# EAGLE design analogTCO-RJ-alone-ext (EAGLE 6.6.0)
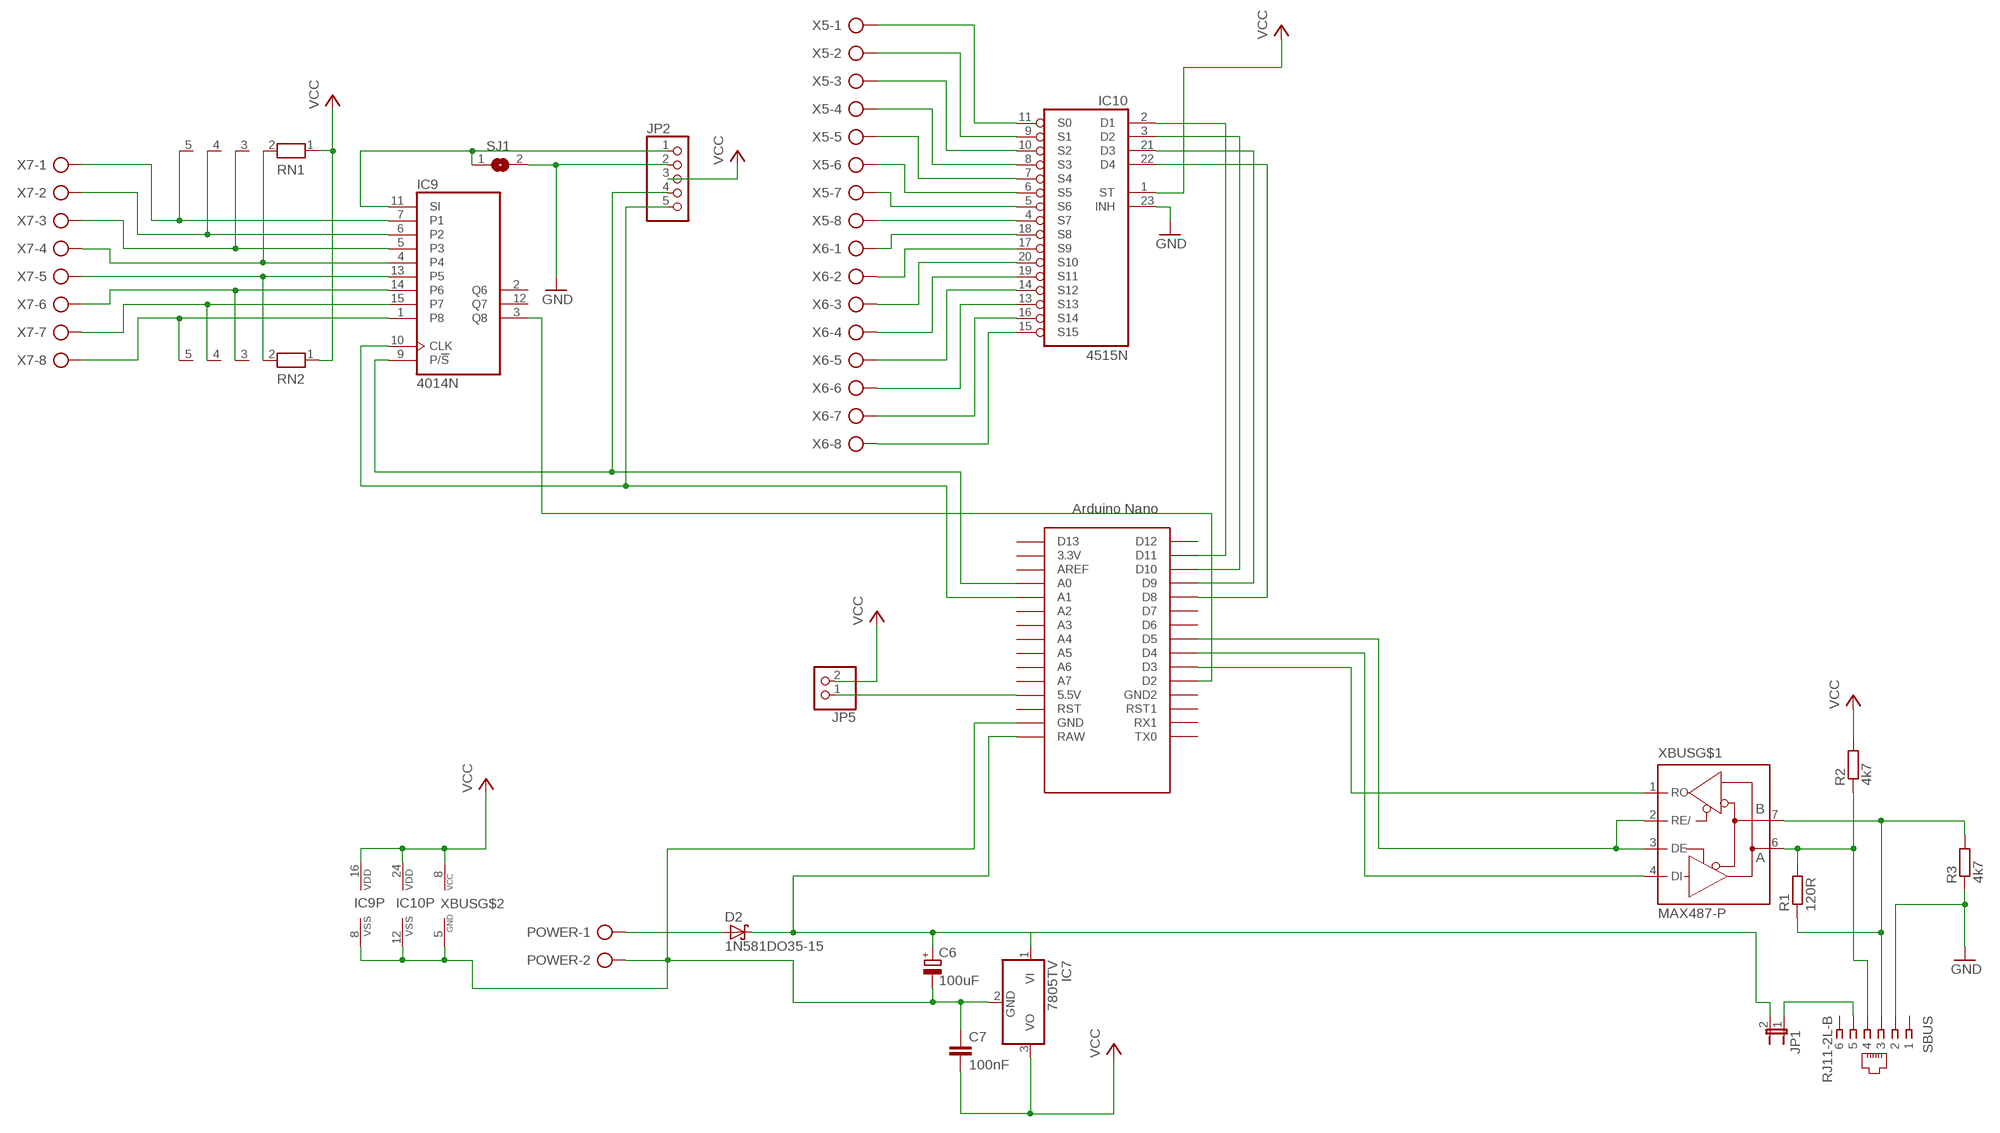
[diagram p0: schematic, sheet 1]

## Parts
C6  100uF  CPOL-EUE2.5-6  [E2,5-6]
C7  100nF  C-EU025-025X050  [C025-025X050]
D2  1N581DO35-15  [DO35-10]
IC7  7805TV  [TO220V]
IC9  4014N  [DIL16]
IC10  4515N  [DIL24-6]
JP1  JP1E  [JP1]
JP2  PINHD-1X5  [1X05]
JP5  PINHD-1X2  [1X02]
POWER  AK500/2  [AK500/2]
R1  120R  R-EU_0207/12  [0207/12]
R2  4k7  R-EU_0207/12  [0207/12]
R3  4k7  R-EU_0207/12  [0207/12]
RN1  RN04  [RN-5]
RN2  RN04  [RN-5]
SBUS  RJ11-2L-B  [RJ11-NO_SHIELD]
SJ1  SJ  [SJ]
U$1  NANO  [NANO]
X5  AK500/8  [AK500/8]
X6  AK500/8  [AK500/8]
X7  AK500/8  [AK500/8]
XBUS  MAX487-P  [DIL08]

## Nets
+12V: C6.+ D2.C IC7.1(VI) JP1.2 U$1.RAW
GND: C6.- C7.1 IC7.2(GND) IC9.8(VSS) IC10.12(VSS) IC10.23(INH) JP2.2 POWER.2 R3.1 SBUS.2 SJ1.2 U$1.GND XBUS.5(GND)
N$1: U$1.D5 XBUS.2(RE/) XBUS.3(DE)
N$2: U$1.D3 XBUS.1(RO)
N$3: U$1.D4 XBUS.4(DI)
N$4: R1.2 R2.1 SBUS.4 XBUS.6(A)
N$5: R1.1 R3.2 SBUS.3 XBUS.7(B)
N$6: JP5.1 U$1.5V(5.5V)
N$8: JP1.1 SBUS.5
N$9: IC9.11(SI) JP2.1 SJ1.1
N$26: IC10.3(D2) U$1.D10
N$27: IC10.2(D1) U$1.D11
N$70: IC9.9(P/!S) JP2.4 U$1.A0
N$71: IC9.10(CLK) JP2.5 U$1.A1
N$73: IC9.3(Q8) U$1.D2
N$74: IC10.11(S0) X5.1
N$75: IC10.9(S1) X5.2
N$76: IC10.10(S2) X5.3
N$77: IC10.8(S3) X5.4
N$78: IC10.7(S4) X5.5
N$79: IC10.6(S5) X5.6
N$80: IC10.5(S6) X5.7
N$81: IC10.4(S7) X5.8
N$82: IC10.18(S8) X6.1
N$83: IC10.17(S9) X6.2
N$84: IC10.20(S10) X6.3
N$85: IC10.19(S11) X6.4
N$86: IC10.14(S12) X6.5
N$87: IC10.13(S13) X6.6
N$88: IC10.16(S14) X6.7
N$89: IC10.15(S15) X6.8
N$90: IC9.7(P1) RN1.5 X7.1
N$91: IC9.6(P2) RN1.4 X7.2
N$92: IC9.5(P3) RN1.3 X7.3
N$93: IC9.4 RN1.2 X7.4
N$94: IC9.13(P5) RN2.2 X7.5
N$95: IC9.14(P6) RN2.3 X7.6
N$96: IC9.15(P7) RN2.4 X7.7
N$97: IC9.1(P8) RN2.5 X7.8
N$98: IC10.21(D3) U$1.D9
N$99: IC10.22(D4) U$1.D8
N$109: D2.A POWER.1
VCC: C7.2 IC7.3(VO) IC9.16(VDD) IC10.1(ST) IC10.24(VDD) JP2.3 JP5.2 R2.2 RN1.1 RN2.1 XBUS.8(VCC)
Unconnected: IC9.2(Q6) IC9.12(Q7) SBUS.1 SBUS.6 U$1.3.3V U$1.A2 U$1.A3 U$1.A4 U$1.A5 U$1.A6 U$1.A7 U$1.AREF U$1.D6 U$1.D7 U$1.D12 U$1.D13 U$1.GND1(GND2) U$1.ICSP1 U$1.ICSP2 U$1.ICSP3 U$1.ICSP4 U$1.ICSP5 U$1.ICSP6 U$1.RST U$1.RST1 U$1.RX1 U$1.TX0

## Library data of the parts
C6 = resistor:CPOL-EU: POLARIZED CAPACITOR, European symbol
C7 = rcl:C-EU: CAPACITOR, European symbol
D2 = custom:1N581*: 1.0A SCHOTTKY BARRIER RECTIFIER Source: http://www.diodes.com/datasheets/ds23001.pdf
IC7 = linear:78*: Positive VOLTAGE REGULATOR Source: http://cache.national.com/ds/LM/LM78L05.pdf http://www.fairchildsemi.com/ds/LM/LM7805.pdf
IC9 = 40xx:4014: 8-bit static SHIFT REGISTER
IC10 = 45xx:4515: 4-bit latch 4-16 line DECODER
JP1 = jumper:JP1E: JUMPER
JP2 = pinhead:PINHD-1X5: PIN HEADER
JP5 = pinhead:PINHD-1X2: PIN HEADER
POWER = con-ptr500:AK500/2: CONNECTOR; OC_FARNELL: unknown; OC_NEWARK: unknown
R1-R3 = resistor:R-EU_: RESISTOR, European symbol
RN1 RN2 = resistor-net:RN04: RESISTOR NETWORK; OC_FARNELL: unknown; OC_NEWARK: unknown
SBUS = con-tycoelectronics:RJ11: CORCOM Modular RJ Jacks No Shield Source: www.tycoelectronics.com .. ENG_DS_1654001_1099_RJ_L_0507.pdf; MF: TYCO ELECTRONICS; MPN: RJ11-2L-B; OC_FARNELL: unknown; OC_NEWARK: 83F4463
SJ1 = jumper:SJ: SMD solder JUMPER
U$1 = Arduino-clone:NANO: Arduino Nano
X5-X7 = con-ptr500:AK500/8: CONNECTOR; OC_FARNELL: unknown; OC_NEWARK: unknown
XBUS = rs232-rs485:MAX487: RS485 TRANSEIVER

## Board
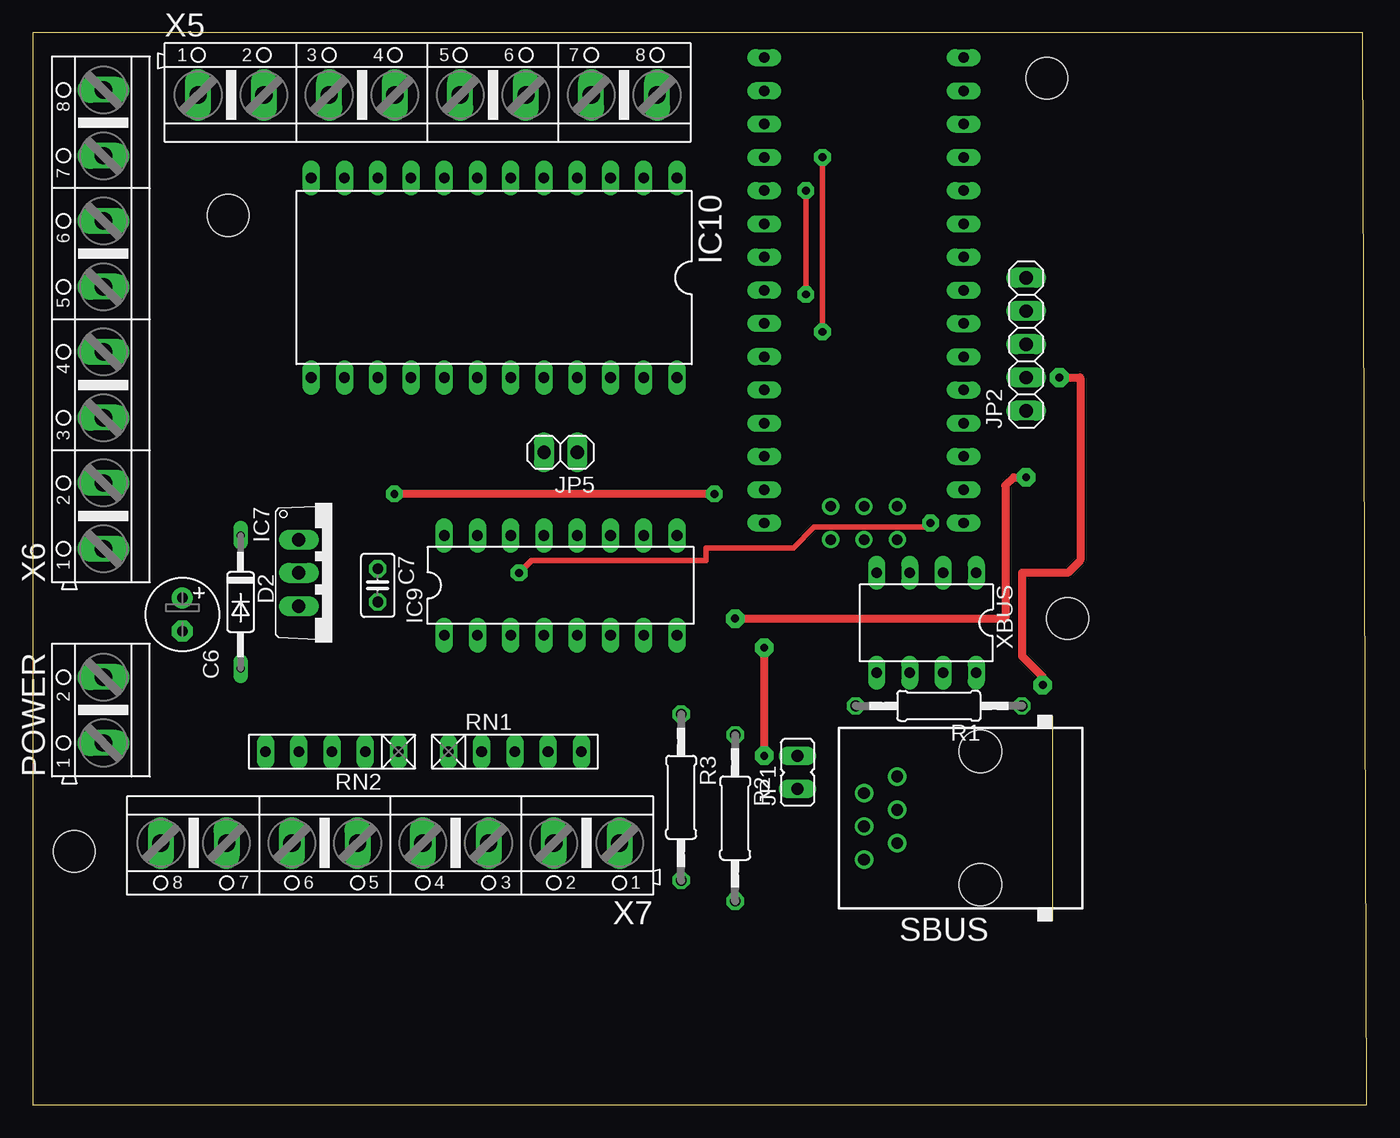
[diagram p1: board, top side]
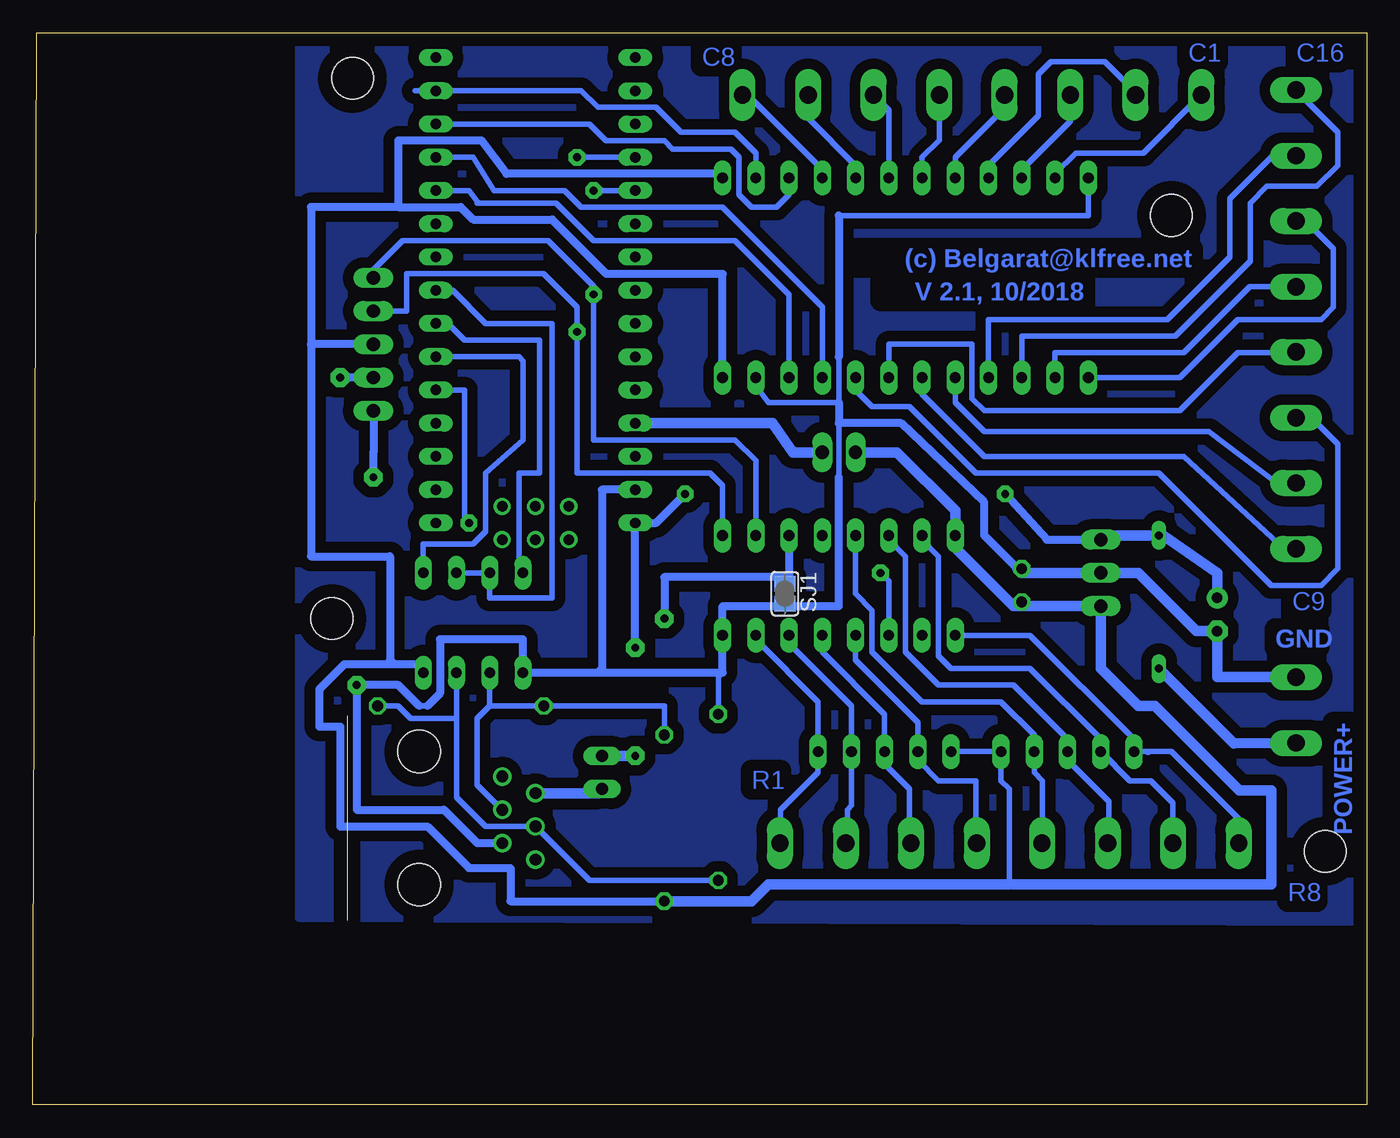
[diagram p2: board, bottom side, seen from below]

Size 101.91 x 81.91 mm. Coordinates in mm from the lower left corner, seen from the top.
Outline: 0,0 101.9,0 101.59,81.91 0,81.91 0,0
Copper layers (1*16): Top 0.035mm / dielectric 1.5mm / Bottom 0.035mm
Design rules "default *": minimum track width 10mil, minimum drill 0.6mm, track to track 8mil, track to pad 8mil, pad to pad 8mil, via to via 8mil, smd to smd 8mil, copper to edge 40mil, drill to drill 8mil, minimum pad ring 10mil, minimum via ring 8mil, stop-mask expansion 4mil, vias tented up to drill 0mil, thermal gap 10mil
Holes 3.2 mm at 77.47,78.42 79.06,37.15 3.17,19.37 14.92,67.94

### Footprints (pad centres in the part's own frame; a part is rotated, then mirrored left to right if it is on the bottom)
E2,5-6 = drill 0.813 pad 1.6: + -1.27,0 | drill 0.813 pad 1.6 octagon: - 1.27,0
C025-025X050 = drill 0.813 octagon: 1 -1.27,0; 2 1.27,0
DO35-10 = drill 0.6 long: A 5.08,0; C -5.08,0
TO220V = drill 1.016 long: 1 -2.54,-2.54; 2 0,-2.54; 3 2.54,-2.54
DIL16 = drill 0.813 long: 1 -8.89,-3.81; 2 -6.35,-3.81; 3 -3.81,-3.81; 4 -1.27,-3.81; 5 1.27,-3.81; 6 3.81,-3.81; 7 6.35,-3.81; 8 8.89,-3.81; 9 8.89,3.81; 10 6.35,3.81; 11 3.81,3.81; 12 1.27,3.81; 13 -1.27,3.81; 14 -3.81,3.81; 15 -6.35,3.81; 16 -8.89,3.81
DIL24-6 = drill 0.813 long: 1 -13.97,-7.62; 2 -11.43,-7.62; 3 -8.89,-7.62; 4 -6.35,-7.62; 5 -3.81,-7.62; 6 -1.27,-7.62; 7 1.27,-7.62; 8 3.81,-7.62; 9 6.35,-7.62; 10 8.89,-7.62; 11 11.43,-7.62; 12 13.97,-7.62; 13 13.97,7.62; 14 11.43,7.62; 15 8.89,7.62; 16 6.35,7.62; 17 3.81,7.62; 18 1.27,7.62; 19 -1.27,7.62; 20 -3.81,7.62; 21 -6.35,7.62; 22 -8.89,7.62; 23 -11.43,7.62; 24 -13.97,7.62
JP1 = drill 0.914 long: 1 0,-1.27; 2 0,1.27
1X05 = drill 1.016 long: 1 -5.08,0; 2 -2.54,0; 3 0,0; 4 2.54,0; 5 5.08,0
1X02 = drill 1.016 long: 1 -1.27,0; 2 1.27,0
AK500/2 = drill 1.321 long: 1 -2.515,0; 2 2.515,0
0207/12 = drill 0.813 octagon: 1 -6.35,0; 2 6.35,0
RN-5 = drill 0.813 long: 1 -5.08,0; 2 -2.54,0; 3 0,0; 4 2.54,0; 5 5.08,0
RJ11-NO_SHIELD = drill 0.9 pad 1.4: 1 -3.175,8.89; 2 -1.905,6.35; 3 -0.635,8.89; 4 0.635,6.35; 5 1.905,8.89; 6 3.175,6.35 | hole 3.251: -5.08,0; 5.08,0
SJ = smd 1.168 x 1.6: 1 -0.762,0; 2 0.762,0
NANO = drill 0.8 long: 3.3V -10.16,24.13; 5V -10.16,-1.27; A0 -10.16,19.05; A1 -10.16,16.51; A2 -10.16,13.97; A3 -10.16,11.43; A4 -10.16,8.89; A5 -10.16,6.35; A6 -10.16,3.81; A7 -10.16,1.27; AREF -10.16,21.59; D2 5.08,1.27; D3 5.08,3.81; D4 5.08,6.35; D5 5.08,8.89; D6 5.08,11.43; D7 5.08,13.97; D8 5.08,16.51; D9 5.08,19.05; D10 5.08,21.59; D11 5.08,24.13; D12 5.08,26.67; D13 -10.16,26.67; GND -10.16,-6.35; GND1 5.08,-1.27; RAW -10.16,-8.89; RST -10.16,-3.81; RST1 5.08,-3.81; RX1 5.08,-6.35; TX0 5.08,-8.89 | drill 0.8: ICSP1 -5.08,-10.16; ICSP2 -5.08,-7.62; ICSP3 -2.54,-10.16; ICSP4 -2.54,-7.62; ICSP5 0,-10.16; ICSP6 0,-7.62
AK500/8 = drill 1.321 long: 1 -17.526,0; 2 -12.497,0; 3 -7.518,0; 4 -2.489,0; 5 2.489,0; 6 7.518,0; 7 12.497,0; 8 17.526,0
DIL08 = drill 0.8 long: 1 -3.81,-3.81; 2 -1.27,-3.81; 3 1.27,-3.81; 4 3.81,-3.81; 5 3.81,3.81; 6 1.27,3.81; 7 -1.27,3.81; 8 -3.81,3.81

### Placement (x,y rotation side)
C6  11.43,37.47 270 top
C7  26.35,39.69 270 top
D2  15.88,38.42 270 top
IC7  22.86,40.64 270 top
IC9  40.32,39.69 0 top
IC10  35.24,63.18 180 top
JP1  58.42,25.4 0 top
JP2  75.88,58.1 90 top
JP5  40.32,49.85 180 top
POWER  5.4,30.16 90 top
R1  69.22,30.48 180 top
R2  53.66,21.91 270 top
R3  49.53,23.49 270 top
RN1  36.83,26.99 0 top
RN2  22.86,26.99 180 top
SBUS  72.39,21.91 90 top
SJ1  44.45,39.05 270 bottom
U$1  66.04,53.34 0 top
X5  30.16,77.15 0 top
X6  5.4,60.01 90 top
X7  27.3,20 180 top
XBUS  68.26,36.83 180 top

### Tracks (layer width: path | path; a pad name or v marks a point on that pad's centre or on a via)
+12V  (via drill 0.6 pad 1.27, 0.6 pad 1.42)
  Top 0.61: v52.07,46.67 v27.62,46.67 | v55.88,26.67 v55.88,34.93
  Bottom 0.61: v52.07,46.67 54.29,44.45 U$1.RAW 55.64,44.21 arc45 55.88,44.03 v55.88,34.93 | v27.62,46.67 24.45,43.18 IC7.1
  Bottom 0.813: C6.+ 11.43,40.64 15.56,43.5 D2.C 20,43.5 IC7.1 | v55.88,26.67 JP1.2
GND  (via drill 0.6 pad 1.42)
  Top 0.61: v78.42,55.56 80.01,55.56 80.01,41.59 79.06,40.64 75.57,40.64 75.57,34.29 77.15,32.7 v77.15,32.07
  Bottom 0.406: IC10.23 46.67,54.93 45.72,53.66 40.32,53.66 40.32,57.15 | IC10.12 21.27,67.94 40.32,67.94 | 40.32,52.07 40.32,47.94 | R3.1 49.53,32.7 49.21,33.02 | 71.76,30.48 72.39,30.48
  Bottom 0.61: 45.09,38.1 49.21,38.1 IC9.8 49.21,33.02 58.74,33.02 | 45.09,38.1 40.32,38.1 40.32,47.94 | 40.32,53.66 40.32,52.07 35.56,52.07 29.21,46.04 29.21,43.5 26.67,40.96 | 40.32,67.94 40.32,57.15 | 58.74,33.02 XBUS.5 64.45,35.56 70.8,35.56 70.8,31.43 71.76,30.48 | 72.39,30.48 73.98,32.07 v77.15,32.07 77.15,22.54 70.48,22.54 67.95,20 SBUS.2 | U$1.GND 58.42,46.99 58.42,33.34 58.74,33.02 | JP2.2 v78.42,55.56 | SJ1.2 44.89,38.29 45.09,38.1
  Bottom 0.813: POWER.2 5.4,32.7 11.43,32.7 C6.- 13.02,36.19 17.46,40.64 IC7.2 | IC7.2 20.64,40.64 20.95,40.32 20.64,40.32 IC7.2 | IC7.2 26.35,40.64 C7.1 26.67,40.96
N$1
  Bottom 0.406: XBUS.2 XBUS.3 66.99,38.73 62.23,38.73 62.23,59.69 67.31,59.69 69.85,62.23 U$1.D5
N$2
  Bottom 0.406: U$1.D3 64.77,57.15 64.45,56.83 64.45,50.8 67.31,48.26 67.31,43.82 68.26,42.86 72.07,42.86 XBUS.1
N$3
  Bottom 0.406: XBUS.4 64.77,40.96 64.77,48.26 63.18,48.26 63.18,58.42 68.9,58.42 70.17,59.69 U$1.D4
N$4
  Bottom 0.406: XBUS.6 66.99,30.48 | 66.99,30.48 R1.2 53.66,30.48 R2.1 | SBUS.4 67.95,24.45 67.95,29.53 66.99,30.48
N$5
  Bottom 0.406: XBUS.7 69.53,29.53 | 69.53,29.53 73.03,29.53 73.98,30.48 R1.1 | 69.53,29.53 69.53,23.49 67.31,21.27 SBUS.3 59.37,17.15 R3.2
N$6
  Bottom 0.813: U$1.5V 45.4,52.07 43.81,49.85 JP5.1
N$7
  pour Bottom (isolate 0.813): 0.63,81.6 81.6,81.91 81.6,14.29 0.63,13.97
N$8
  Bottom 0.813: SBUS.5 58.74,23.81 JP1.1
N$9  (via drill 0.6 pad 1.42)
  Top 0.61: v53.66,37.15 74.29,37.15 74.29,47.31 74.93,47.94 v75.88,47.94
  Bottom 0.61: IC9.11 44.13,40.32 45.09,40.32 | 45.09,40.32 53.66,40.32 v53.66,37.15 | JP2.1 75.88,52.39 75.88,49.85 v75.88,47.94 | SJ1.1 44.58,39.81 45.09,40.32
N$26
  Bottom 0.406: U$1.D10 59.37,74.93 58.1,73.66 53.66,73.66 53.02,73.02 48.58,73.02 47.94,72.39 47.94,69.53 46.99,68.58 45.09,68.58 44.13,69.53 IC10.3
N$27
  Bottom 0.406: 72.71,77.47 U$1.D11 60.01,77.47 58.74,76.2 54.29,76.2 52.39,74.3 48.26,74.3 46.67,72.71 IC10.2
N$70  (via drill 0.6 pad 1.27)
  Top 0.406: v60.32,72.39 v60.32,59.05
  Bottom 0.406: U$1.A0 v60.32,72.39 | IC9.9 49.21,47.31 50.17,48.26 60.32,48.26 v60.32,59.05 60.32,60.96 62.87,63.5 73.34,63.5 73.34,60.64 JP2.4
N$71  (via drill 0.6 pad 1.27)
  Top 0.406: v59.06,61.91 v59.06,69.85
  Bottom 0.406: IC9.10 46.67,49.21 48.26,50.8 59.06,50.8 v59.06,61.91 59.06,62.55 62.55,66.04 73.66,66.04 75.88,63.82 JP2.5 | v59.06,69.85 U$1.A1
N$73  (via drill 0.6 pad 1.27)
  Top 0.406: v37.15,40.64 38.1,41.59 51.43,41.59 51.43,42.54 58.1,42.54 59.69,44.13 68.26,44.13 v68.58,44.45
  Bottom 0.406: U$1.D2 68.9,54.61 68.9,44.77 v68.58,44.45 | IC9.3 36.51,40.01 v37.15,40.64
N$74
  Bottom 0.406: IC10.11 23.81,71.12 22.22,72.71 17.08,72.71 X5.1
N$75
  Bottom 0.406: X5.2 17.67,77.36 20,79.69 24.13,79.69 25.08,78.74 25.08,75.57 28.89,71.76 IC10.9
N$76
  Bottom 0.406: X5.3 22.64,75.15 26.35,71.44 IC10.10
N$77
  Bottom 0.406: X5.4 27.67,76.15 31.43,72.39 IC10.8
N$78
  Bottom 0.406: X5.5 32.65,73.71 33.97,72.39 IC10.7
N$79
  Bottom 0.406: IC10.6 36.51,75.98 X5.6
N$80
  Bottom 0.406: X5.7 42.66,75.36 39.05,71.76 IC10.5
N$81
  Bottom 0.406: X5.8 47.31,77.15 41.59,71.44 IC10.4
N$82
  Bottom 0.406: X6.1 6.29,42.48 13.97,49.53 29.21,49.53 33.97,54.29 IC10.18
N$83
  Bottom 0.406: X6.2 6.87,47.51 12.06,51.43 29.21,51.43 31.43,53.66 IC10.17
N$84
  Bottom 0.406: X6.3 4.23,52.49 2.22,50.48 2.22,40.96 3.49,39.69 7.3,39.69 15.87,48.26 29.85,48.26 34.92,53.34 37.78,53.34 39.05,54.61 IC10.20
N$85
  Bottom 0.406: IC10.19 36.51,58.1 30.16,58.1 30.16,53.97 29.21,53.02 14.29,53.02 9.84,57.47 5.98,57.47 X6.4
N$86
  Bottom 0.406: X6.5 8.94,62.5 13.97,57.47 23.81,57.47 IC10.14
N$87
  Bottom 0.406: X6.6 4.66,67.53 2.54,65.41 2.54,60.96 3.49,60.01 9.84,60.01 14.29,55.56 IC10.13
N$88
  Bottom 0.406: X6.7 7.19,72.5 10.48,69.21 10.48,64.77 15.24,60.01 28.89,60.01 IC10.16
N$89
  Bottom 0.406: X6.8 5.4,77.47 2.22,74.3 2.22,71.76 3.81,70.17 7.62,70.17 8.89,68.9 8.89,64.45 14.61,58.74 26.35,58.74 IC10.15
N$90
  Bottom 0.406: X7.1 44.77,20.07 44.77,22.54 41.91,25.4 RN1.5 41.91,30.8 46.67,35.56 IC9.7
N$91
  Bottom 0.406: X7.2 39.69,20.12 39.69,22.54 39.37,22.86 RN1.4 39.37,30.48 44.13,35.24 IC9.6
N$92
  Bottom 0.406: X7.3 34.92,20.1 34.92,24.13 36.83,26.04 RN1.3 36.83,29.84 41.59,34.61 IC9.5
N$93
  Bottom 0.406: X7.4 29.85,20.05 29.85,24.77 32.7,24.77 34.29,26.35 RN1.2 34.29,29.21 39.05,33.97 IC9.4
N$94
  Bottom 0.406: IC9.13 39.05,39.05 37.78,37.78 37.78,34.61 33.97,30.8 27.94,30.8 25.4,28.26 RN2.2 25.4,25.4 24.76,24.77 24.76,20.05 X7.5
N$95
  Bottom 0.406: IC9.14 36.51,43.18 35.24,41.91 35.24,34.61 32.7,32.07 26.99,32.07 22.86,27.94 RN2.3 22.86,26.35 19.69,23.18 19.69,20.1 X7.6
N$96
  Bottom 0.406: IC9.15 33.97,43.18 32.7,41.91 32.7,34.29 31.75,33.34 25.72,33.34 20.32,27.94 RN2.4 18.1,24.77 16.51,24.77 14.81,23.06 X7.7
N$97
  Bottom 0.406: 16.87,26.99 arc45 16.69,26.91 16.76,26.99 RN2.5 | X7.8 9.78,21.84 14.92,26.99 RN2.5 | IC9.1 25.72,35.88 17.78,27.94 RN2.5
N$98
  Bottom 0.406: U$1.D9 68.26,72.39 66.68,69.85 61.28,69.85 60.01,68.58 49.21,68.58 41.59,60.96 IC10.21 41.59,56.51
N$99
  Bottom 0.406: U$1.D8 68.58,69.85 67.86,68.88 | 67.86,68.88 67.95,68.9 | IC10.22 44.13,61.91 48.26,66.04 59.06,66.04 61.91,68.9 67.84,68.9 67.86,68.88
N$109
  Bottom 0.813: POWER.1 5.42,27.65 10.16,27.62 D2.A
VCC
  Bottom 0.406: RN1.1 RN2.1 27.94,24.77 27.31,24.13 27.31,16.83 26.99,16.83
  Bottom 0.61: XBUS.8 72.07,33.65 74.29,33.65 | 74.29,33.65 78.1,33.65 80.01,31.75 80.01,28.89 78.42,28.89 78.42,21.27 71.76,21.27 68.58,18.1 65.41,18.1 65.41,15.56 53.02,15.56 | IC10.24 49.21,63.5 58.1,63.5 62.23,67.63 68.26,67.63 69.21,68.58 73.98,68.58 | 73.98,68.58 80.65,68.58 80.65,58.1 | 80.65,58.1 80.65,41.91 74.61,41.91 74.61,33.97 74.29,33.65 | IC10.1 49.53,71.12 65.72,71.12 67.63,73.66 73.98,73.66 73.98,68.58 | JP2.3 80.65,58.1
  Bottom 0.813: IC7.3 26.35,38.1 C7.2 | IC7.3 26.99,38.1 31.43,42.54 IC9.16 31.43,45.4 35.88,49.85 JP5.2 | 26.99,16.83 7.3,16.83 7.3,24.02 9.74,24.02 16.19,30.48 17.46,30.48 20.32,33.34 IC7.3 | R2.2 53.02,15.56 46.99,15.56 45.72,16.83 27.31,16.83

### Text on the board
Bottom: C16 | C1 | C8 | (c) Belgarat@klfree.net | V 2.1, 10/2018 | C9 | GND | POWER+ | R1 | R8